# EAGLE design NodeMCU-Gateway (EAGLE 7.6.0)
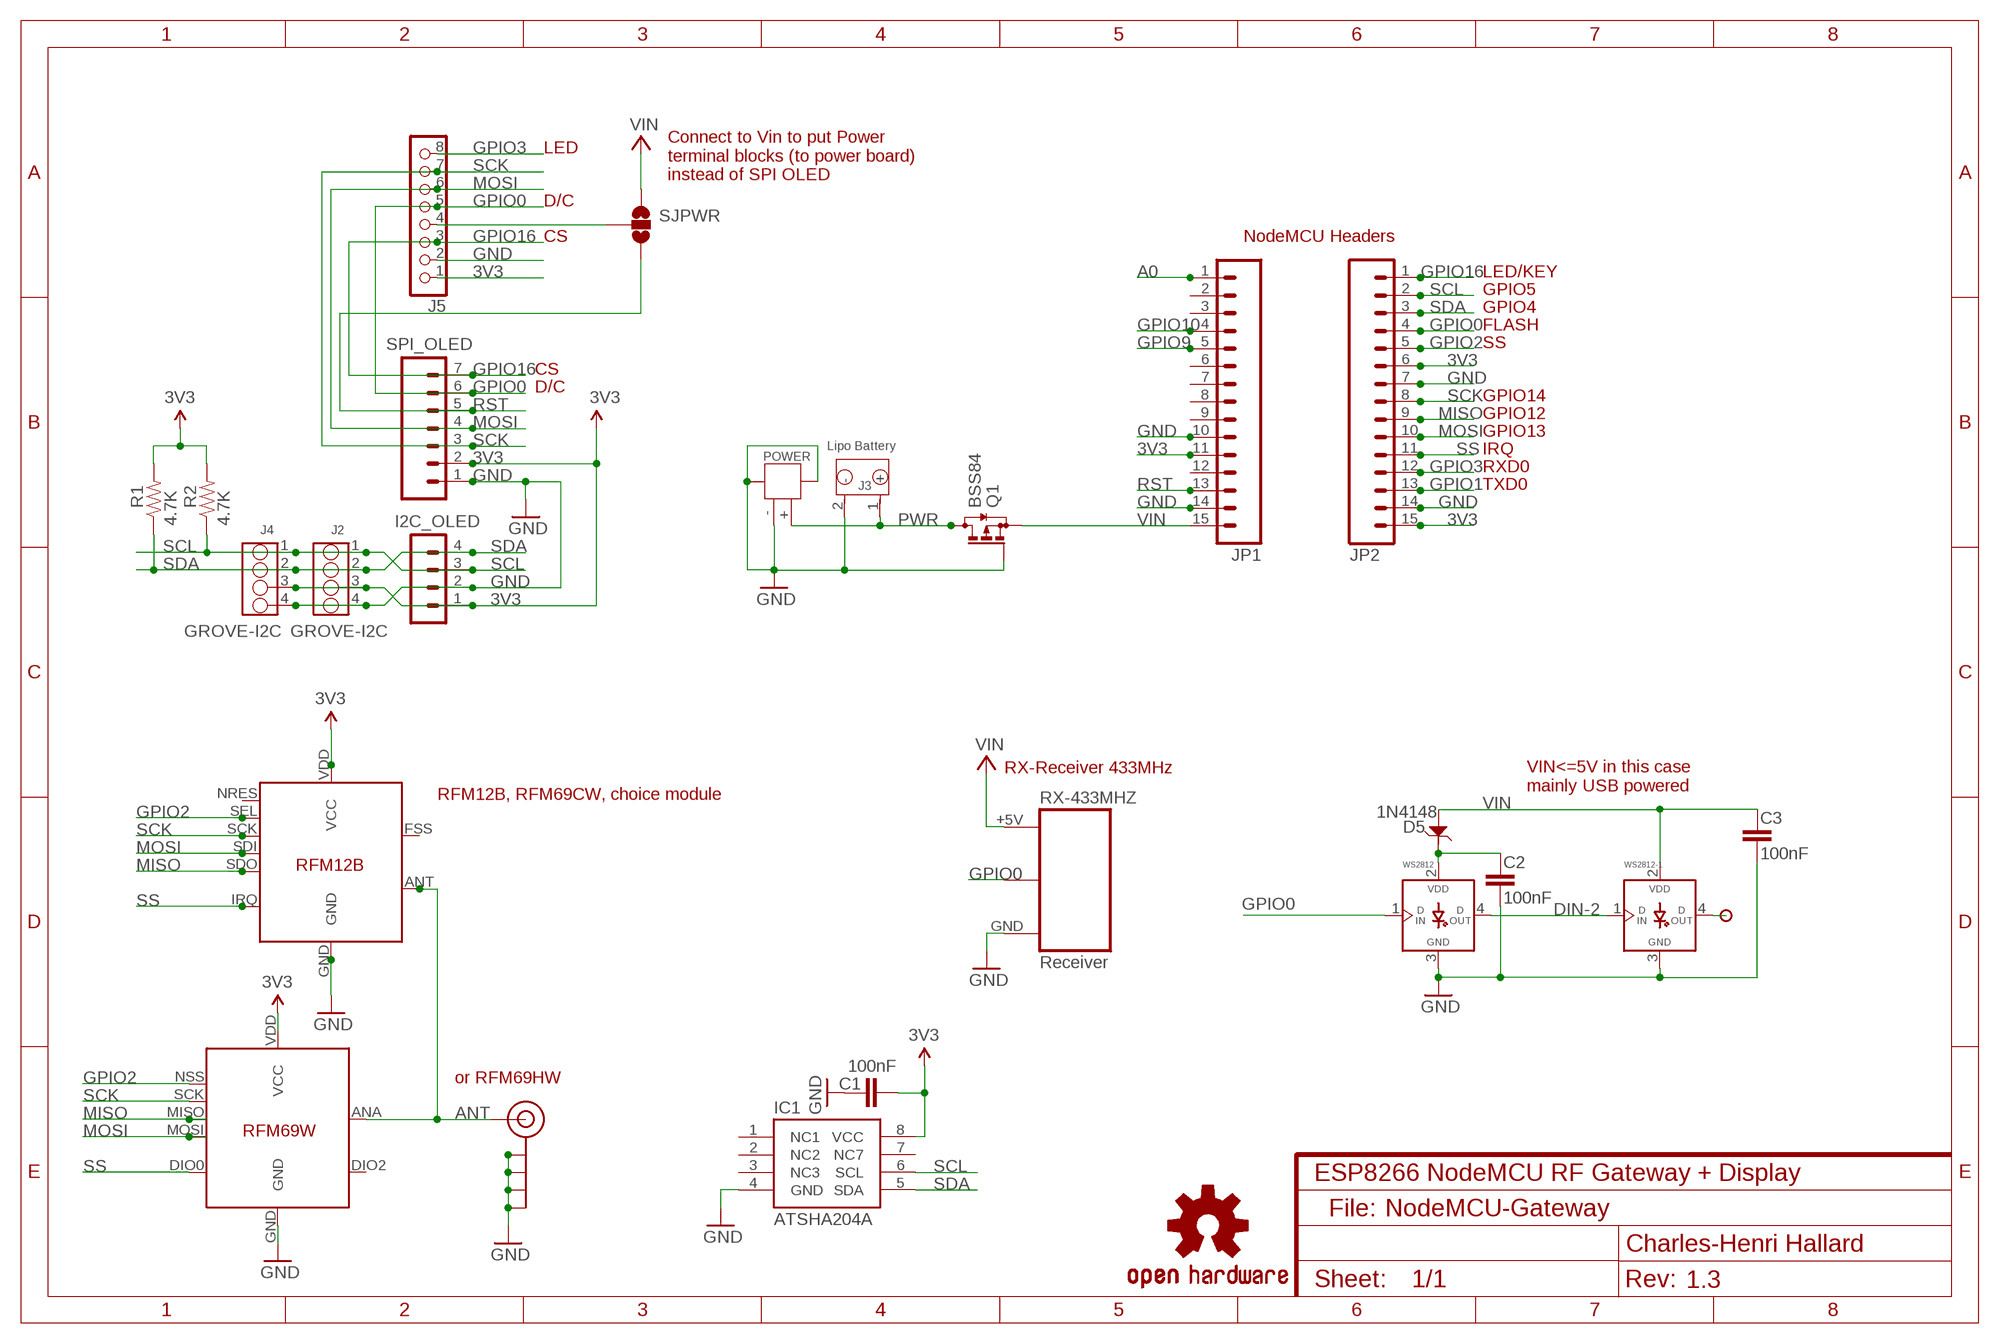
[diagram p0: schematic, sheet 1]
NAME (FRAME-A4L): CNAME: ESP8266 NodeMCU RF Gateway + Display; CREVISION: 1.3; DESIGNER: Charles-Henri Hallard

## Parts
C1  100nF  CAP0805-CAP  [0805-CAP]
C2  100nF  CAP0805-CAP  [0805-CAP]
C3  100nF  CAP0805-CAP  [0805-CAP]
D5  1N4148  D-ESD-2P-CESD5V0D1  [SOD123-2.7X1.6]
I2C_OLED  CON_HEADER_1X04'LOCK'  [1X04_LOCK]
IC1  ATSHA204A  ATSHA204_SOIC8  [SOIC8]
J2  GROVE-I2C  GROVE-4P-2.0-3470140P1  [4P-2.0-90D]
J3  Lipo Battery  JST-2P-PW-3410070P1  [2P-2.0-90D]
J4  GROVE-I2C  GROVE-4P-2.0-3470130P1  [4P-2.0]
J5  CON_HEADER_1X08-PTH  [M1X8]
J$2  ANTENNATINY  [SMA_UFL_PAD_TINY]
JP1  M15LOCK  [1X15_LOCK]
JP2  M15LOCK  [1X15_LOCK]
LOGO2  OSHW-LOGOL  [OSHW-LOGO-L]
P2  PADNORMAL  [PAD]
POWER  JST-2P-SMD'2.0'  [2P-SMD-2.0-90D]
Q1  BSS84  [SOT23]
R1  4.7K  RESISTOR0805-RES  [0805-RES]
R2  4.7K  RESISTOR0805-RES  [0805-RES]
RX-433MHZ  Receiver  RF-LINK_RX  [RF-LINK_RX_NO_SILK]
SJPWR  JUMPER-PAD-3-2OF3_NC_BY_TRACE_LARGE  [PAD-JUMPER-3-2OF3_NC_BY_TRACE_YES_SILK_LARGE]
SPI_OLED  CON_HEADER_1X07'SMALL'  [M1X7]
U$2  RFM12B  [RFM12B-MINPADS]
U$3  RFM69W  [RFM69W-MINPADS]
WS2812  WS2812B  WS2812B5MM  [WS2812-PTH]
WS2812-1  WS2812B  WS2812B5MM  [WS2812-PTH]

## Nets
3V3: C1.2 I2C_OLED.1 IC1.8(VCC) J2.3 J4.3 J5.1 JP1.11 JP2.6 JP2.15 R1.2 R2.2 SPI_OLED.2 U$2.VDD(VCC) U$3.VDD(VCC)
A0: JP1.1
ANT: J$2.ANT1(SIGNAL) J$2.ANT2(SIGNAL) J$2.ANT3(SIGNAL) U$2.ANT U$3.ANA(ANT)
DIN-2: WS2812-1.1(DIN) WS2812.4(DOUT)
GND: C1.1 C2.1 C3.1 I2C_OLED.2 IC1.4(GND) J2.4 J3.2(-) J4.4 J5.2 J$2.GND1(GND) J$2.GND2(GND) J$2.GND3(GND) J$2.GND4(GND) JP1.10 JP1.14 JP2.7 JP2.14 POWER.3 POWER.4 POWER.- Q1.1(G) RX-433MHZ.GND SPI_OLED.1 U$2.GND U$3.GND WS2812-1.3(GND) WS2812.3(GND)
GPIO0: J5.5 JP2.4 RX-433MHZ.DATA@1(DATA) RX-433MHZ.DATA@2(DATA) SPI_OLED.6 WS2812.1(DIN)
GPIO1: JP2.13
GPIO2: JP2.5 U$2.SEL U$3.NSS(SEL)
GPIO3: J5.8 JP2.12
GPIO9: JP1.5
GPIO10: JP1.4
GPIO16: J5.3 JP2.1 SPI_OLED.7
MISO: JP2.9 U$2.SDO U$3.MISO
MOSI: J5.6 JP2.10 SPI_OLED.4 U$2.SDI U$3.MOSI
N$1: P2.1 WS2812-1.4(DOUT)
N$2: J5.4 SJPWR.2
N$3: C2.2 D5.2 WS2812.2(VDD)
PWR: J3.1(+) POWER.+ Q1.3(D)
RST: JP1.13 SJPWR.3 SPI_OLED.5
SCK: J5.7 JP2.8 SPI_OLED.3 U$2.SCK U$3.SCK
SCL: I2C_OLED.3 IC1.6(SCL) J2.1 J4.1 JP2.2 R2.1
SDA: I2C_OLED.4 IC1.5(SDA) J2.2 J4.2 JP2.3 R1.1
SS: JP2.11 U$2.IRQ U$3.DIO0
VIN: C3.2 D5.1 JP1.15 Q1.2(S) RX-433MHZ.+5V SJPWR.1 WS2812-1.2(VDD)
Unconnected: IC1.1(NC1) IC1.2(NC2) IC1.3(NC3) IC1.7(NC7) JP1.2 JP1.3 JP1.6 JP1.7 JP1.8 JP1.9 JP1.12 U$2.FSS(FFS) U$2.NRES U$3.DIO2

## Notes on the sheet
- LED
- Connect to Vin to put Power
  terminal blocks (to power board)
  instead of SPI OLED
- D/C
- CS | NodeMCU Headers
- LED/KEY
- GPIO5
- GPIO4
- FLASH
- SS
- CS
- D/C
- GPIO14
- GPIO12
- GPIO13
- IRQ
- RXD0
- TXD0
- RX-Receiver 433MHz
- VIN<=5V in this case
  mainly USB powered
- RFM12B, RFM69CW, choice module
- or RFM69HW
- File:

## Library data of the parts
C1-C3 = _c2h:CAP: Capacitor Standard 0603 ceramic capacitor, and 0.1" leaded capacitor.
D5 = Seeed-Discrete:D-ESD-2P: Diodes for Protectiong against ESD
I2C_OLED = _c2h:CON_HEADER_1X04
IC1 = SparkFun-DigitalIC:ATSHA204_SOIC8: ATSHA204; PROD_ID: IC-11981
J2 J4 = seeed-opl-Connector:GROVE-4P-2.0
J3 = Seeed-Connector:JST-2P-PW
J5 = dp_devices:CON_HEADER_1X08
J$2 = _c2h:ANTENNA: SMA Antenna Connector End launch SMA connector. The paste layer has been removed so that the connector can be hand soldered onto the board after reflow.
JP1 JP2 = SparkFun-Connectors:M15: Header 15 Standard 15-pin 0.1" header. Use with straight break away headers (SKU : PRT-00116), right angle break away headers (PRT-00553), swiss pins (PRT-00743), machine pins (PRT-00117), and female headers (PRT-00115).
LOGO2 = SparkFun-Aesthetics:OSHW-LOGO: Open Source Hardware Logo This logo indicates the piece of hardware it is found on incorporates a OSHW license and/or adheres to the definition of open source hardware found here: http://freedomdefined.org/OSHW
P2 = _c2h:PAD
POWER = Seeed-Connector:JST-2P-SMD: 2P-SMD-2.0-90D:320110026
Q1 = transistor-small-signal:BSS84: P-CHANNEL MOS FET
R1 R2 = _c2h:RESISTOR: Resistor Basic schematic elements and footprints for 0603, 1206, and PTH resistors.
RX-433MHZ = _c2h:RF-LINK_RX: RF Link receivers- WRL-8947, 8948, 8949, 8950, 10532, 10533
SJPWR = SparkFun-Passives:JUMPER-PAD-3-2OF3_NC_BY_TRACE
SPI_OLED = _c2h:CON_HEADER_1X07
U$2 = _c2h:RFM12B
U$3 = _c2h:RFM69W
WS2812 WS2812-1 = _c2h:WS2812B

## Net classes
0 default: width 0.203 mm, drill 0.356 mm, clearance 0.152 mm
1 power: width 0.203 mm, clearance 0.152 mm

## Board
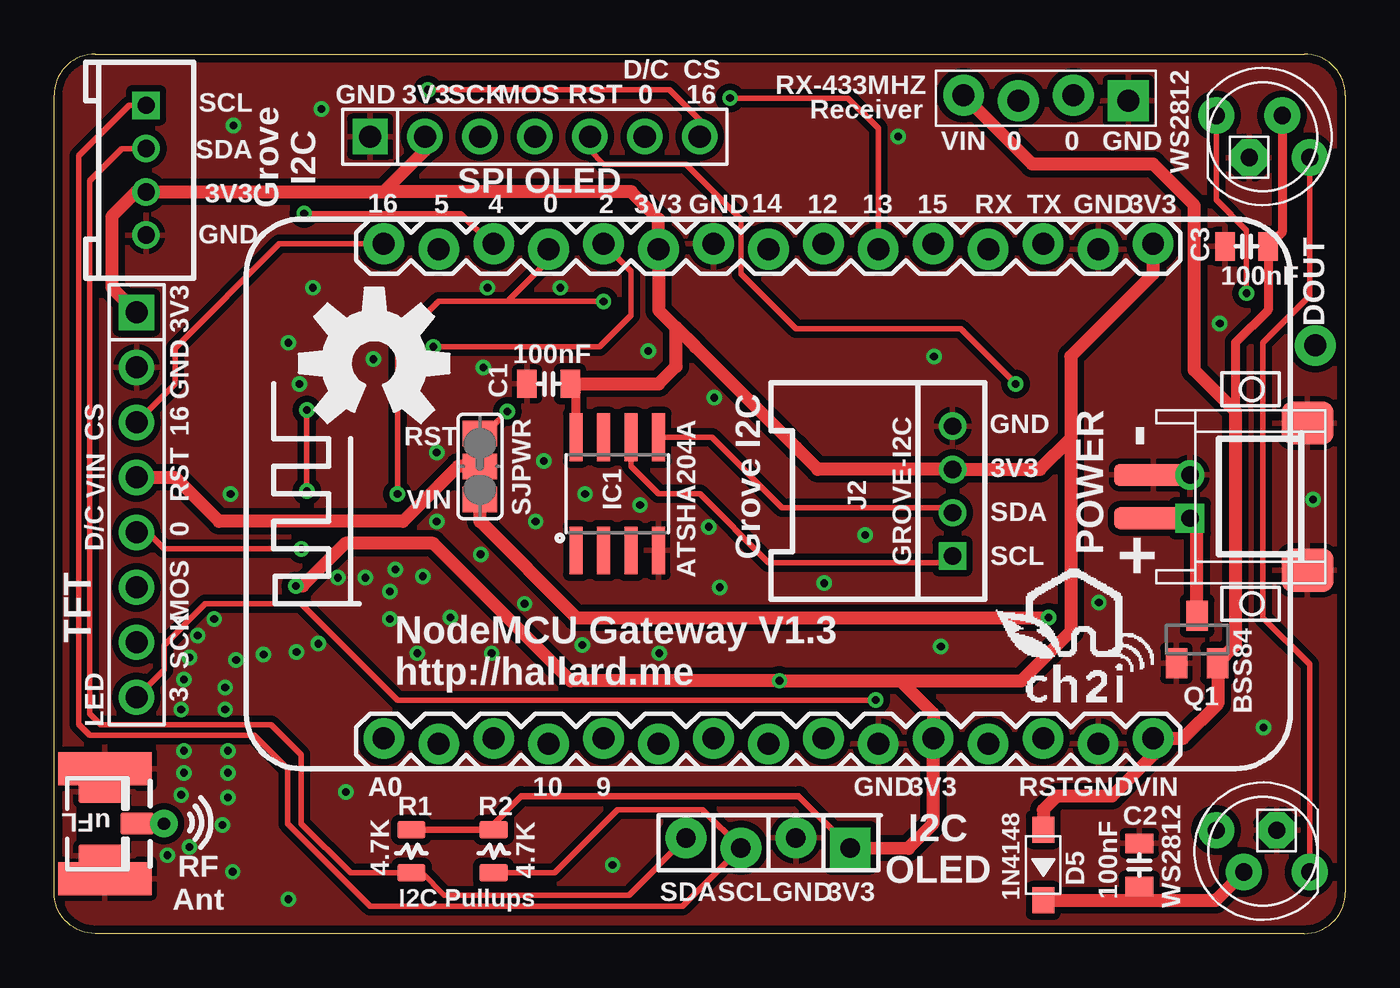
[diagram p1: board, top side]
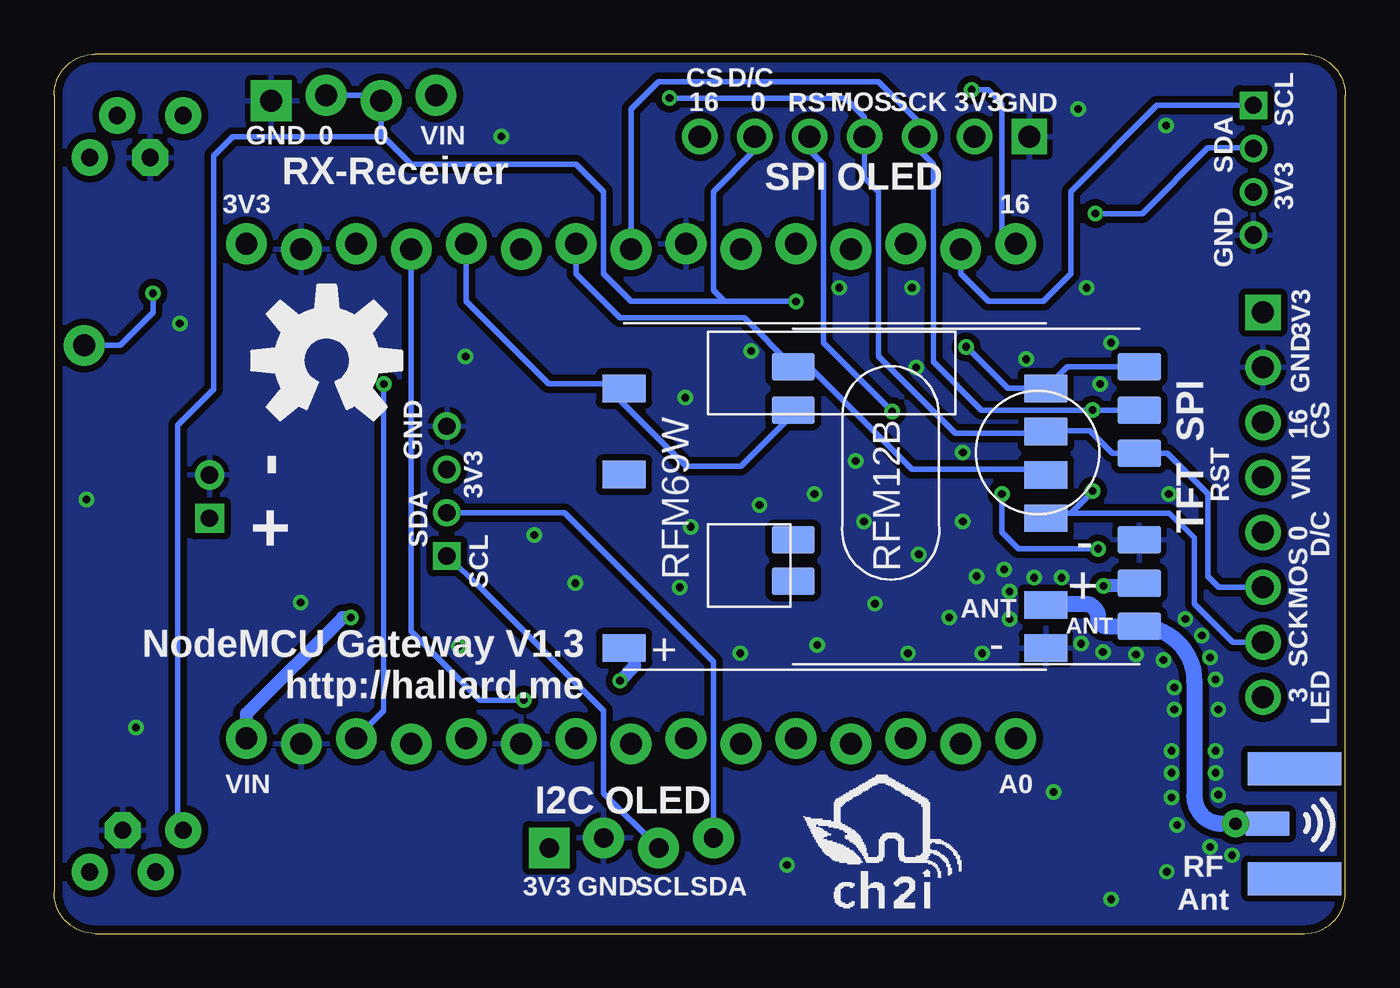
[diagram p2: board, bottom side, seen from below]

Size 59.69 x 40.64 mm. Coordinates in mm from the lower left corner, seen from the top.
Outline: 1.91,40.64 57.78,40.64 arc-90 59.69,38.73 59.69,1.91 arc-90 57.78,0 1.91,0 arc-90 0,1.91 0,38.73 arc-90 1.91,40.64
Copper layers (1*16): Top 0.0356mm / dielectric 1.5011mm / Bottom 0.0356mm
Design rules "PCBs_io": minimum track width 6mil, minimum drill 13mil, track to track 6mil, track to pad 6mil, pad to pad 6mil, via to via 6mil, smd to smd 6mil, copper to edge 15mil, drill to drill 6mil, minimum pad ring 7mil, minimum via ring 7mil, stop-mask expansion 3mil, vias tented up to drill 40mil, thermal gap 10mil

### Footprints (pad centres in the part's own frame; a part is rotated, then mirrored left to right if it is on the bottom)
0805-CAP = smd 0.902 x 1.3: 1 -1,0; 2 1,0
SOD123-2.7X1.6 = smd 1.2 x 1.02: 1 -1.635,0; 2 1.635,0
1X04_LOCK = drill 0.9 pad 1.88 square: 1 1.295,1.372 | drill 0.9 pad 1.88: 2 3.81,0.914; 3 6.35,1.372; 4 8.89,0.914
SOIC8 = smd 0.61 x 2.21: 1 -1.905,-2.616; 2 -0.635,-2.616; 3 0.635,-2.616; 4 1.905,-2.616; 5 1.905,2.616; 6 0.635,2.616; 7 -0.635,2.616; 8 -1.905,2.616
4P-2.0-90D = drill 0.8 pad 1.27 square: 1 -3,0 | drill 0.8 pad 1.27: 2 -1,0; 3 1,0; 4 3,0
2P-2.0-90D = drill 0.8 pad 1.35 square: 1 -1,3.25 | drill 0.8 pad 1.35: 2 1,3.25
4P-2.0 = drill 0.8 pad 1.27 square: 1 -3,0 | drill 0.8 pad 1.27: 2 -1,0; 3 1,0; 4 3,0
M1X8 = drill 1.02 pad 1.632 square: 1 -8.89,0 | drill 1.02 pad 1.632: 2 -6.35,0; 3 -3.81,0; 4 -1.27,0; 5 1.27,0; 6 3.81,0; 7 6.35,0; 8 8.89,0
SMA_UFL_PAD_TINY = smd 1.524 x 1.016: ANT1 -3.843,0 | drill 0.559 pad 1.27: ANT2 -5.08,0 | smd 2.032 x 1.143 bottom: ANT3 -3.589,0 | smd 2.2 x 1.016: GND1 -2.223,1.47; GND2 -2.223,-1.47 | smd 4.318 x 1.524: GND3 -2.349,-2.54; GND4 -2.349,2.54 | smd 4.318 x 1.524 bottom: GND5 -2.349,2.54; GND6 -2.349,-2.54
1X15_LOCK = drill 1.016 pad 1.88: 1 0,0.127; 2 2.54,-0.127; 3 5.08,0.127; 4 7.62,-0.127; 5 10.16,0.127; 6 12.7,-0.127; 7 15.24,0.127; 8 17.78,-0.127; 9 20.32,0.127; 10 22.86,-0.127; 11 25.4,0.127; 12 27.94,-0.127; 13 30.48,0.127; 14 33.02,-0.127; 15 35.56,0.127
PAD = drill 1.016 pad 1.88: 1 0,0
2P-SMD-2.0-90D = smd 2 x 2.4: 3 3.4,-2.181; 4 -3.4,-2.181 | smd 1 x 3.6: + -1,4.953; - 1,4.953
SOT23 = smd 1 x 1.4: 1 -0.95,-1.1; 2 0.95,-1.1; 3 0,1.1
0805-RES = smd 0.8 x 1.3: 1 -1,0; 2 1,0
RF-LINK_RX_NO_SILK = drill 1.016 pad 1.88: +5V 7.62,1.143; DATA@1 2.54,1.143; DATA@2 5.08,1.397 | drill 1.016 pad 1.88 square: GND 0,1.397
PAD-JUMPER-3-2OF3_NC_BY_TRACE_YES_SILK_LARGE = smd 1.168 x 1.6: 1 -1.524,0; 2 0,0; 3 1.524,0
M1X7 = drill 1.02 pad 1.632 square: 1 -6.35,0 | drill 1.02 pad 1.632: 2 -3.81,0; 3 -1.27,0; 4 1.27,0; 5 3.81,0; 6 6.35,0; 7 8.89,0
RFM12B-MINPADS = smd 2 x 1.27: ANT 8,-6; FSS -8.002,-2; GND 8,-2; IRQ -8,4; NRES -8.002,-3.905; SCK 8,4; SDI 8,2; SDO -8,6; SEL 8,6; VDD 8,-4
RFM69W-MINPADS = smd 2 x 1.27: ANA 8,-5; DIO0 -11.5,5; DIO2 -11.5,1.012; GND 8,-7; MISO 8,1; MOSI 8,3; NSS 8,5; SCK 8,-1; VDD -11.5,-7
WS2812-PTH = drill 0.8 pad 1.676: 1 2.159,-0.968; 2 0.889,0.968; 4 -2.159,0.968 | drill 0.8 pad 1.676 octagon: 3 -0.635,-0.968

### Placement (x,y rotation side)
C1  22.86,25.4 0 top
C2  50.16,3.17 270 top
C3  55.12,31.75 0 top
D5  45.72,3.17 270 top
I2C_OLED  38.1,5.33 180 top
IC1  26.04,20.32 0 top
J2  41.53,20.45 90 top
J3  55.75,20.19 90 top
J4  4.25,35.27 270 top
J5  3.81,19.81 270 top
J$2  0,5.08 180 top
JP1  15.24,8.89 0 top
JP2  15.24,31.75 0 top
LOGO1  OSHW-LOGOL  [OSHW-LOGO-L]  14.8,26.35 0 top
LOGO2  47.09,26.48 0 bottom
P2  58.29,27.18 0 top
POWER  55.75,20.19 90 top
Q1  52.83,13.59 0 top
R1  16.51,3.81 90 top
R2  20.32,3.81 90 top
RX-433MHZ  49.66,39.88 180 top
SJPWR  19.68,21.59 90 top
SPI_OLED  20.95,36.83 0 top
U$1  [LOGO_CH2I_75MM]  47.62,12.7 0 top
U$2  17.53,20.19 0 bottom
U$3  21.84,20.19 0 bottom
U$4  [LOGO_CH2I_75MM]  20.95,3.17 0 bottom
WS2812  55.88,3.81 180 top
WS2812-1  55.88,36.83 0 top

### Tracks (layer width: path | path; a pad name or v marks a point on that pad's centre or on a via)
3V3  (via drill 0.36 pad 0.61, 0.36 pad 0.71)
  Top 0.254: 29.32,27.43 29.65,27.11
  Top 0.305: R2.2 R1.2 20.05,4.81 21.59,6.35 34.42,6.35 I2C_OLED.1
  Top 0.406: IC1.8 24.13,25.04 C1.2
  Top 0.61: I2C_OLED.1 39.5,3.94 40.64,5.08 JP1.11 40.64,10.16 39.12,11.68 | 15.24,34.29 17.14,36.2 SPI_OLED.2 | 15.24,34.29 26.67,34.29 27.94,33.02 JP2.6 27.94,28.81 28.75,28 | 15.24,34.29 15.22,34.27 J4.3 3.79,34.27 2.67,33.15 2.67,29.84 J5.1 | 28.75,28 29.65,27.11 34.29,22.46 | 39.12,11.68 v33.53,11.68 23.88,11.68 17.53,18.03 13.46,18.03 11.49,16.07 v11.18,16.07 | 34.29,22.46 34.31,22.46 | 34.29,22.46 35.31,21.45 J2.3 45.58,21.45 46.99,22.86 | JP2.15 50.8,30.48 46.99,26.67 46.99,22.86 | 46.99,22.86 46.99,13.97 44.7,11.68 39.12,11.68 | C1.2 27.94,25.4 28.75,26.21 28.75,28
  Bottom 0.61: U$2.VDD 10.48,16.07 v11.18,16.07 | U$3.VDD 32.85,13.21 32.85,12.38 v33.53,11.68
ANT
  Top 0.254: J$2.ANT1 J$2.ANT2
  Bottom 0.254: J$2.ANT3 J$2.ANT2
  Bottom 0.61: J$2.ANT2 5.71,5.08
  Bottom 0.75: 5.71,5.08 arc90 6.99,6.35 6.99,11.65 arc-90 U$2.ANT 11.02,14.19 arc90 11.43,14.61 arc-90 12.06,15.24 13.8,15.24 arc-90 U$3.ANA
DIN-2
  Top 0.254: WS2812.4 58.04,12.45 55.88,14.61 55.88,27.3 58.04,29.46 WS2812-1.1
GND  (via drill 0.36 pad 0.71)
  other vias: 40.67,26.67 13.49,6.54 10.83,1.59 22.26,19.05 18.32,14.61 11.97,29.84 8.26,2.86 48.29,15.3 39.02,36.83 55.91,9.53 12.35,38.1 35.59,16.19 23.4,29.84 10.83,27.3 8.29,37.34 30.51,24.77 37.5,18.41 20.03,29.84 40.99,13.27 6,8.45 6,7.43 5.87,6.41 5.24,3.62 6.25,4 7.78,5.02 8.03,6.29 8.03,7.43 8.03,8.45 6,11.75 7.91,11.37 8.41,12.64 9.68,12.89 11.21,13.02 12.22,13.4 7.91,10.35 6.64,13.78 7.4,14.54 6.25,12.76 14.38,16.45 15.78,16.83 15.53,15.81 15.53,14.54 13.11,16.45 17.05,16.51 17.68,19.05 17.68,22.23 8.16,20.32 11.33,25.4 19.84,26.16 14.76,26.54 21.75,15.24 19.72,17.53 22.64,21.84 24.54,20.32 27.08,19.81 5.87,10.35 24.42,13.34 27.97,12.95 30.77,16 27.46,26.92 30.26,18.8 20.22,12.95 16.8,12.95 25.81,3.17 53.88,28.19 58.2,20.07
  pour Bottom (isolate 0.305): 60.96,41.91 60.96,-1.27 -1.14,-1.4 -1.14,41.78
  pour Top (isolate 0.305): -0.51,41.15 60.33,41.27 60.33,-0.64 -0.51,-0.76
GPIO0  (via drill 0.36 pad 0.71)
  Top 0.254: J5.5 4.32,18.54 5.08,17.78 v11.43,17.78 | 20.95,29.21 17.78,29.21 15.88,27.3 v15.88,20.32 | 20.95,29.21 v25.4,29.21 | JP2.4 22.86,31.11 20.95,29.21
  Bottom 0.254: SPI_OLED.6 27.3,36.2 29.21,34.29 29.21,29.72 28.7,29.21 | 28.7,29.21 v25.4,29.21 | 44.45,36.83 44.58,36.96 RX-433MHZ.DATA@2 44.83,38.73 RX-433MHZ.DATA@1 | 44.45,36.83 43.18,35.56 35.56,35.56 34.29,34.29 34.29,30.48 33.02,29.21 28.7,29.21 | 44.45,36.83 51.44,36.83 52.32,35.94 52.32,25.15 53.98,23.5 53.98,5.03 WS2812.1 | v11.43,17.78 15.11,17.78 15.88,18.54 v15.88,20.32
GPIO2  (via drill 0.36 pad 0.71)
  Top 0.254: v17.53,27.11 25.21,27.11 26.67,28.57 26.67,30.61 JP2.5
  Bottom 0.254: U$2.SEL 12.84,26.19 U$3.NSS 15.6,25.19 v17.53,27.11
GPIO3  (via drill 0.36 pad 0.71)
  Top 0.254: v37.97,10.79 15.88,10.79 11.43,15.24 6.99,15.24 5.08,13.34 5.08,12.19 J5.8
  Bottom 0.254: v37.97,10.79 40.01,10.79 43.18,13.97 JP2.12
GPIO16  (via drill 0.36 pad 0.71)
  Top 0.254: JP2.1 10.41,31.88 5.59,27.05 5.59,25.4 J5.3 | SPI_OLED.7 29.84,37.59 28.45,38.99 v17.27,38.99
  Bottom 0.254: v17.27,38.99 16.51,38.99 15.88,38.35 15.88,32.51 JP2.1
MISO
  Bottom 0.254: 14.11,21.46 20.03,21.46 25.14,26.57 | JP2.9 35.56,30.48 33.53,28.45 27.78,28.45 U$2.SDO
  Bottom 0.406: 14.11,21.46 U$3.MISO | 25.14,26.57 U$2.SDO
MOSI  (via drill 0.36 pad 0.71)
  Top 0.254: v31.24,38.61 36.7,38.61 38.1,37.21 JP2.10
  Bottom 0.254: U$2.SDI 9.49,22.19 | 13.92,23.11 18.03,23.11 21.59,26.67 21.59,34.29 22.23,34.92 SPI_OLED.4 22.23,37.72 23.11,38.61 v31.24,38.61 | 13.8,23.24 11.81,23.24 10.76,22.19 U$2.SDI | J5.6 5.84,16 6.35,16.51 6.35,20.32 8.22,22.19 U$2.SDI
  Bottom 0.406: 13.8,23.24 U$3.MOSI 13.92,23.11
N$1  (via drill 0.36 pad 0.71)
  Top 0.254: WS2812-1.4 53.72,33.91 55.12,32.51 v55.12,29.59
  Bottom 0.254: v55.12,29.59 55.12,28.7 56.64,27.18 P2.1
N$2
  Top 0.61: SJPWR.2 18.67,21.59 16.13,19.05 7.62,19.05 5.59,21.08 J5.4
N$3
  Top 0.61: D5.2 50.16,1.54 | 50.16,1.54 53.69,1.54 WS2812.2 | C2.2 50.16,1.54
PWR
  Top 0.61: Q1.3 52.83,18.86 J3.1 POWER.+
RST  (via drill 0.36 pad 0.71)
  Top 0.254: SPI_OLED.5 24.77,36.2 25.4,35.56 29.21,35.56 31.75,33.02 31.75,30.48 34.29,27.94 41.91,27.94 v44.45,25.4 | SJPWR.3 19.68,22.86 v20.95,24.13
  Bottom 0.254: SPI_OLED.5 24.77,36.2 24.13,35.56 24.13,27.3 v20.95,24.13 | v44.45,25.4 44.45,10.29 JP1.13
SCK  (via drill 0.36 pad 0.71)
  Top 0.254: v11.68,20.45 v11.68,24.19
  Bottom 0.254: 8.79,24.19 v11.68,24.19 16.83,24.19 19.05,26.42 19.05,35.56 19.68,36.2 SPI_OLED.3 19.68,37.47 21.59,39.37 31.75,39.37 33.02,38.1 JP2.8 | J5.7 5.21,13.46 6.99,15.24 6.99,18.29 8.13,19.43 12.7,19.43 | U$3.SCK 13.84,19.43 12.7,19.43 | 12.7,19.43 v11.68,20.45
  Bottom 0.406: U$2.SCK 8.79,24.19
SCL
  Top 0.254: J4.1 3.48,38.27 1.14,35.94 1.14,9.68 1.65,9.18 9.24,9.18 10.79,7.62 10.79,5.08 14.61,1.27 29.06,1.27 I2C_OLED.3 29.97,5.71 26.04,5.71 23.13,2.81 R2.1 | IC1.6 26.67,21.59 27.94,20.32 29.84,20.32 33.02,17.14 41.23,17.14 J2.1
  Bottom 0.254: J4.1 8.72,38.27 12.7,34.29 12.7,30.48 13.97,29.21 16.51,29.21 17.78,30.48 JP2.2 | I2C_OLED.3 34.29,6.48 34.29,10.29 40.26,16.26 J2.1
SDA  (via drill 0.36 pad 0.71)
  Top 0.254: J4.2 3.13,36.27 1.65,34.8 1.65,10.16 2.16,9.65 10.03,9.65 11.43,8.26 11.43,5.08 13.7,2.81 R1.1 17,2.81 18.03,1.78 26.57,1.78 I2C_OLED.4 | JP2.3 20.19,31.88 18.8,33.27 v11.56,33.27 | IC1.5 30.4,22.94 33.66,19.68 41.29,19.68 J2.2
  Bottom 0.254: v11.56,33.27 9.4,33.27 6.35,36.32 4.3,36.32 J4.2 | I2C_OLED.4 29.21,12.57 36.08,19.45 J2.2
SS
  Bottom 0.254: JP2.11 40.64,29.21 36.83,25.4 34.29,25.4 | U$2.IRQ 25.53,24 27.94,21.59 30.48,21.59 34.29,25.4 | 34.29,25.4 33.55,25.4 U$3.DIO0
VIN  (via drill 0.36 pad 0.71)
  Top 0.406: WS2812-1.2 56.77,32.4 C3.2 56.12,28.81 54.61,27.3 54.61,23.5
  Top 0.61: RX-433MHZ.+5V 45.21,35.56 50.8,35.56 52.7,33.66 52.7,26.04 54.61,24.13 54.61,23.5 54.61,13.32 Q1.2 53.78,10.6 52.2,9.02 JP1.15 50.8,8.26 48.9,6.35 46.35,6.35 45.72,5.71 D5.1 | v45.97,14.61 24.13,14.61 19.68,19.05 SJPWR.1
  Bottom 0.61: v45.97,14.61 46.35,14.61 50.8,10.16 JP1.15

### Text on the board
tNames: D/C | CS | WS2812 | SCL | GND | 3V3 | SCK | MOS | 0 | 16 | RST | SDA | Grove / I2C | VIN | 0 | 0 | GND | 3V3 | SPI OLED | 16 | 5 | 4 | 0 | 2 | 3V3 | GND | 14 | 12 | 13 | 15 | RX | TX | GND | 3V3 | GND | 3V3 | DOUT | GND | CS | Grove I2C | 16 | RST | GND | - | VIN | RST | 3V3 | D/C | VIN | 0 | SDA | + | TFT | MOS | SCL | SCK | LED | 3 | NodeMCU Gateway V1.3 / http://hallard.me | A0 | A0 | 10 | 9 | GND | 3V3 | RST | GND | VIN | I2C / OLED | RF / Ant | I2C Pullups | SDA | SCL | GND | 3V3
bNames: GND | 3V3 | SCK | MOS | 0 | D/C | 16 | CS | RST | SCL | 3V3 | RX-Receiver | VIN | 0 | 0 | GND | SDA | GND | SPI OLED | 16 | 16 | 3V3 | 3V3 | TFT SPI | GND | GND | CS | 16 | - | RST | VIN | 3V3 | SDA | + | 0 | SCL | D/C | MOS | NodeMCU Gateway V1.3 / http://hallard.me | SCK | 3 | LED | A0 | I2C OLED | VIN | RF / Ant | SDA | SCL | GND | 3V3